# Altium schematic sheet sensor-header.SchDoc
size A
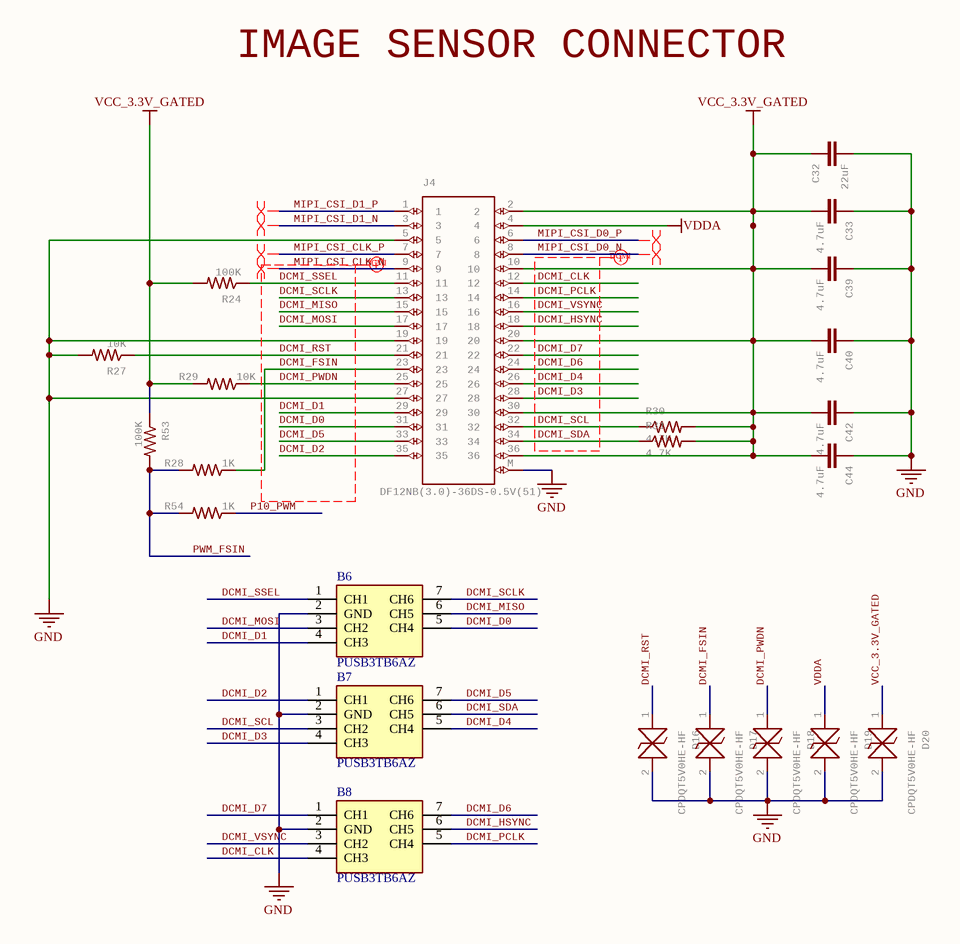
[diagram p0: sensor-header.SchDoc]

## Parts
B6  PUSB3TB6AZ  [PUSB3TB6AZ]
B7  PUSB3TB6AZ  [PUSB3TB6AZ]
B8  PUSB3TB6AZ  [PUSB3TB6AZ]
C32  22uF  [0805]
C33  4.7uF  [0402-CAP]
C39  4.7uF  [0402-CAP]
C40  4.7uF  [0402-CAP]
C42  4.7uF  [0402-CAP]
C44  4.7uF  [0402-CAP]
D16  CPDQT5V0HE-HF  [CPDQT5V0HEHF]
D17  CPDQT5V0HE-HF  [CPDQT5V0HEHF]
D18  CPDQT5V0HE-HF  [CPDQT5V0HEHF]
D19  CPDQT5V0HE-HF  [CPDQT5V0HEHF]
D20  CPDQT5V0HE-HF  [CPDQT5V0HEHF]
J4  DF12NB(3.0)-36DS-0.5V(51)  [DF12-36-DS]
R24  100K  [0402-RES]
R27  10K  [0402-RES]
R28  1K  [0402-RES]
R29  10K  [0402-RES]
R30  4.7K  [0402-RES]
R31  4.7K  [0402-RES]
R53  100K  [0402-RES]
R54  1K  [0402-RES]

## Nets
GND: B6.2(GND) B7.2(GND) B8.2(GND) C32.2 C33.1 C39.1 C40.1 C42.1 C44.1 D16.2 D17.2 D18.2 D19.2 D20.2 J4.5 J4.19 J4.27 J4.M R27.2
VCC_3.3V_GATED: C32.1 C33.2 C39.2 C40.2 C42.2 C44.2 D20.1 J4.2 J4.10 J4.20 J4.30 J4.36 R24.2 R29.2 R30.2 R31.2 R53.1
VDDA: D19.1 J4.4
DCMI_CLK: B8.4(CH3) J4.12
DCMI_D0: B6.5(CH4) J4.31
DCMI_D1: B6.4(CH3) J4.29
DCMI_D2: B7.1(CH1) J4.35
DCMI_D3: B7.4(CH3) J4.28
DCMI_D4: B7.5(CH4) J4.26
DCMI_D5: B7.7(CH6) J4.33
DCMI_D6: B8.7(CH6) J4.24
DCMI_D7: B8.1(CH1) J4.22
DCMI_FSIN: D17.1 J4.23 R28.1
DCMI_HSYNC: B8.6(CH5) J4.18
DCMI_MISO: B6.6(CH5) J4.15
DCMI_MOSI: B6.3(CH2) J4.17
DCMI_PCLK: B8.5(CH4) J4.14
DCMI_PWDN: D18.1 J4.25 R29.1
DCMI_RST: D16.1 J4.21 R27.1
DCMI_SCL: B7.3(CH2) J4.32 R30.1
DCMI_SCLK: B6.7(CH6) J4.13
DCMI_SDA: B7.6(CH5) J4.34 R31.1
DCMI_SSEL: B6.1(CH1) J4.11 R24.1
DCMI_VSYNC: B8.3(CH2) J4.16
MIPI_CSI_CLK_N: J4.9
MIPI_CSI_CLK_P: J4.7
MIPI_CSI_D0_N: J4.8
MIPI_CSI_D0_P: J4.6
MIPI_CSI_D1_N: J4.3
MIPI_CSI_D1_P: J4.1
P10_PWM: R54.1
PWM_FSIN: R28.2 R53.2 R54.2

## Layout directives
net class DCMI: DCMI_CLK, DCMI_D0, DCMI_D1, DCMI_D2, DCMI_D3, DCMI_D4, DCMI_D5, DCMI_D6, DCMI_D7, DCMI_FSIN, DCMI_HSYNC, DCMI_MISO, DCMI_MOSI, DCMI_PCLK, DCMI_PWDN, DCMI_RST, DCMI_SCL, DCMI_SCLK, DCMI_SDA, DCMI_SSEL, DCMI_VSYNC, MIPI_CSI_CLK_N
differential pair; differential pair class MIPI: MIPI_CSI_CLK_N, MIPI_CSI_CLK_P, MIPI_CSI_D0_N, MIPI_CSI_D0_P, MIPI_CSI_D1_N, MIPI_CSI_D1_P

## Notes on the sheet
- IMAGE SENSOR CONNECTOR

## Library data of the parts
B6-B8 = PUSB3TB6AZ: NEXPERIA - PUSB3TB6AZ - DIODE, ESD PROTECTION, 5.5V, 0.27PF; Geometry.Height: 0.5mm; Mouser Part Number: 771-PUSB3TB6AZ; Mouser Price/Stock: https://www.mouser.co.uk/ProductDetail/Nexperia/PUSB3TB6AZ?qs=K2OaAKmNuLgsAI4MRas6Xw%3D%3D; Manufacturer_Name: Nexperia; Manufacturer_Part_Number: PUSB3TB6AZ; Datasheet Link: https://assets.nexperia.com/documents/data-sheet/PUSB3TB6.pdf; Part Number: PUSB3TB6AZ; MPN: PUSB3TB6AZ
C32 = 22UF-0805-6.3V-20%: 22ÂµF ceramic capacitors    A capacitor is a passive two-terminal electrical component used to store electrical energy temporarily in an electric field.; MPN: CL21A226MQQNNNE; GateName_1: G$1; SymbolName_1: CAP; PROD_ID: CAP-08402; DeviceName: -0805-6.3V-20%; LibraryName: SparkFun-Capacitors; DeviceSetName: 22UF; Part Number: CL21A226MQQNNNE
C33 C39 C40 C42 C44 = CAP0402-CAP: CapacitorStandard 0603 ceramic capacitor, and 0.1" leaded capacitor.; MPN: JMK105BBJ475MV-F; GateName_1: G$1; SymbolName_1: CAP; DeviceName: 0402-CAP; LibraryName: sfe; DeviceSetName: CAP; Part Number: JMK105BBJ475MV-F
D16-D20 = CPDQT5V0HE-HF: ESD Suppressors / TVS Diodes DIODE ESD 5VWM 65W 0402/SOD-923F   Source:  Datasheet; MANUFACTURER_NAME: Comchip Technology; GateName_1: G$1; SymbolName_1: CPDQT5V0HE-HF; LibraryName: CPDQT5V0HE-HF; DeviceSetName: CPDQT5V0HE-HF; HEIGHT: 0.42mm; MANUFACTURER_PART_NUMBER: CPDQT5V0HE-HF; MOUSER_PART_NUMBER: MOUSER_PART_NUMBER; MOUSER_PRICE-STOCK: MOUSER_PRICE-STOCK; MPN: CPDQT5V0HE-HF; Part Number: CPDQT5V0HE-HF
J4 = DF12-36-DS: Header; GateName_1: G$1; SymbolName_1: DF12-36; LibraryName: DF12-36-DS; DeviceSetName: DF12-36-DS; MPN: DF12NB(3.0)-36DS-0.5V(51); Part Number: DF12NB(3.0)-36DS-0.5V(51)
R24 R53 = RESISTOR0402-RES: ResistorBasic schematic elements and footprints for 0603, 1206, and PTH resistors.; MPN: AC0402FR-07100KL; GateName_1: G$1; SymbolName_1: RESISTOR; DeviceName: 0402-RES; LibraryName: sfe; DeviceSetName: RESISTOR; Part Number: AC0402FR-07100KL
R27 R29 = RESISTOR0402-RES: ResistorBasic schematic elements and footprints for 0603, 1206, and PTH resistors.; MPN: AC0402FR-1310K; GateName_1: G$1; SymbolName_1: RESISTOR; DeviceName: 0402-RES; LibraryName: sfe; DeviceSetName: RESISTOR; Part Number: AC0402FR-1310K
R28 R54 = RESISTOR0402-RES: ResistorBasic schematic elements and footprints for 0603, 1206, and PTH resistors.; MPN: CRCW04021K00FKEDC; GateName_1: G$1; SymbolName_1: RESISTOR; DeviceName: 0402-RES; LibraryName: sfe; DeviceSetName: RESISTOR; Part Number: CRCW04021K00FKEDC
R30 R31 = RESISTOR0402-RES: ResistorBasic schematic elements and footprints for 0603, 1206, and PTH resistors.; MPN: AC0402FR-074K7L; GateName_1: G$1; SymbolName_1: RESISTOR; DeviceName: 0402-RES; LibraryName: sfe; DeviceSetName: RESISTOR; Part Number: AC0402FR-074K7L